# EasyEDA schematic SCH_场强表sma版_2024-12-23.json
TITLE: Sheet_1; REV: 1.0; Date: 2024-12-06; Sheet: 1/1; Company: Your Company
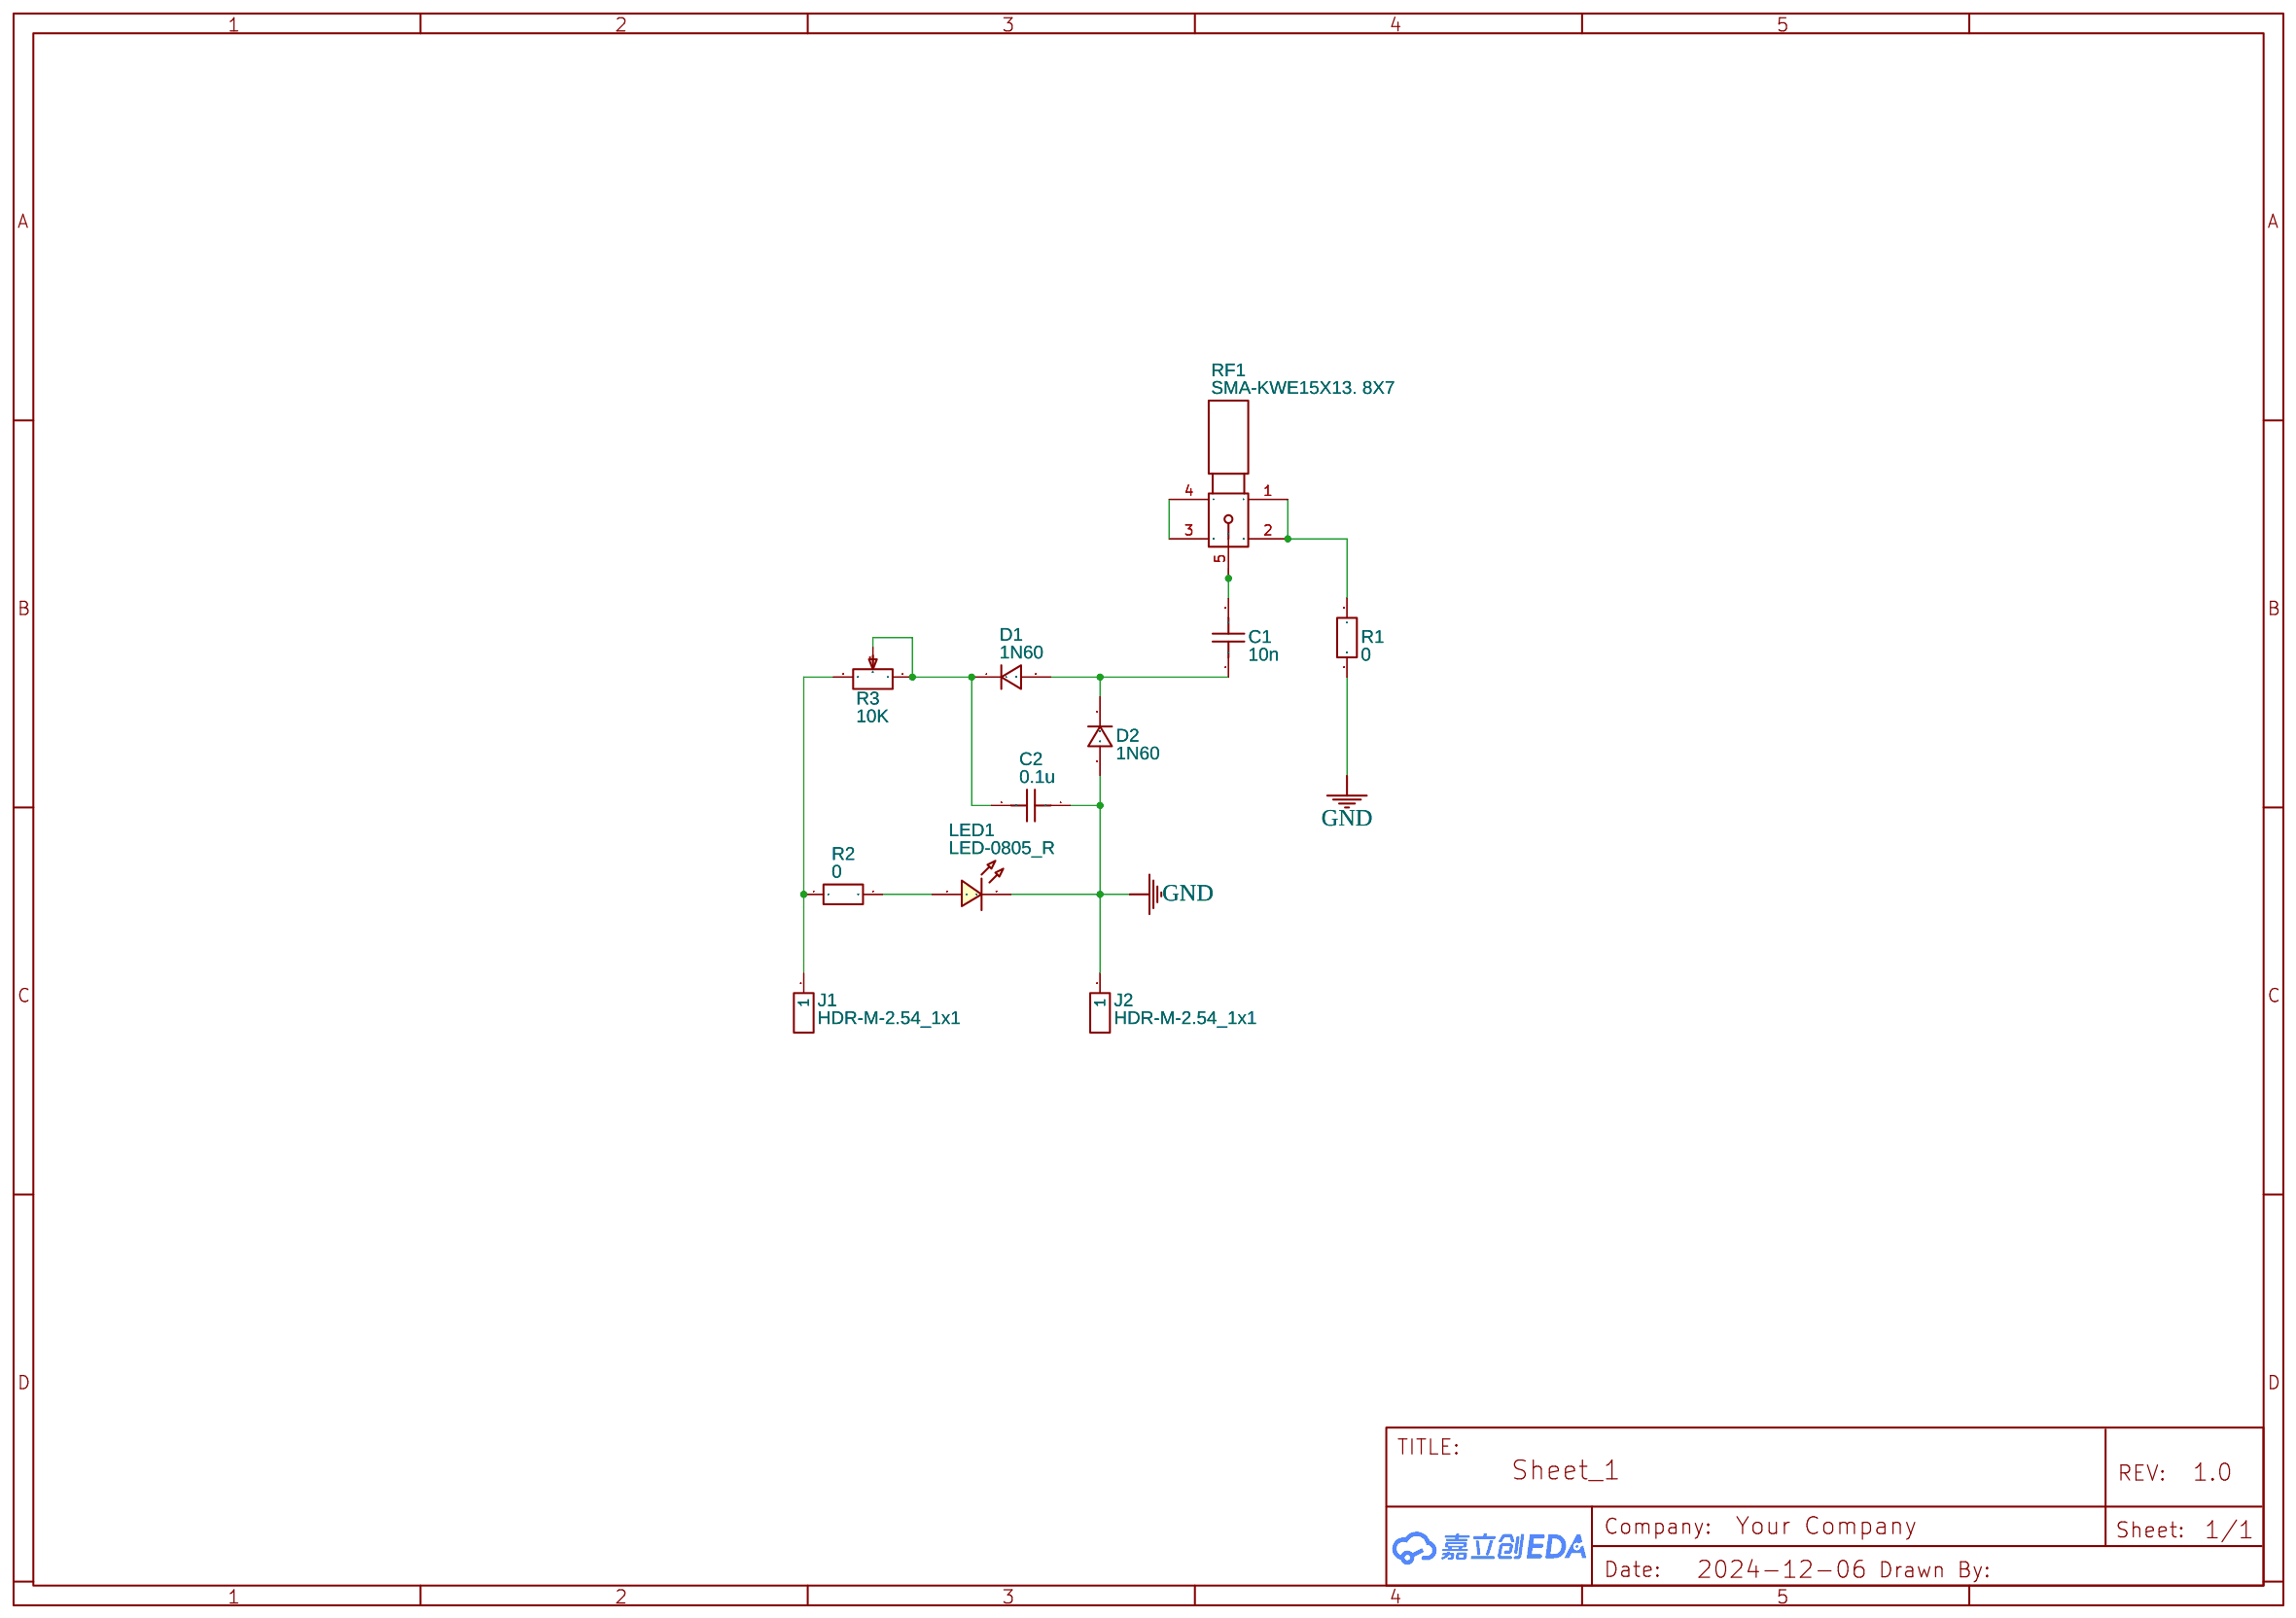
[diagram p0: schematic sheet]

## Parts
C1  10n  [C0603]
C2  0.1u  [C0603]
D1  1N60  [DO-35_BD2.0-L4.2-P8.20-D0.5-RD]
D2  1N60  [DO-35_BD2.0-L4.2-P8.20-D0.5-RD]
J1  HDR-M-2.54_1x1  [HDR-M-2.54_1X1]
J2  HDR-M-2.54_1x1  [HDR-M-2.54_1X1]
LED1  LED-0805_R  [LED0805-RD]
R1  0  [R0603]
R2  0  [R0603]
R3  10K  [RES-ADJ-TH_RK097N]
RF1  SMA-KWE15X13. 8X7  [SMA-TH_SMA-KWE]

## Library data of the parts
C1 C2 = C_0603_US: Contributor: LCEDA_Lib
D1 D2 = 1N4148: Supplier: LCSC; Supplier Part: C13769; Manufacturer: STMicroelectronics; Contributor: LCSC
J1 J2 = HDR-M-2.54_1x1: Supplier Part: C81276; Supplier: LCSC; Contributor: LCEDA_Lib
LED1 = LED-0603_R: Manufacturer: EVERLIGHT(台湾亿光); Manufacturer Part: 19-217/R6C-AL1M2VY/3T; Supplier Part: C72044; Supplier: LCSC; Contributor: LCEDA_01
R1 R2 = R_0603_EU: Contributor: LCEDA_Lib
R3 = WH148: Supplier: LCSC; Manufacturer: ALPS; Supplier Part: C97444; Contributor: gd732
RF1 = SMA-KWE15X13. 8X7: Contributor: LCSC; Supplier: LCSC; Supplier Part: C9900004212; Manufacturer: null

## Nets
GND: C2.1 D2.2 J2.1 LED1.2 R1.1
Net-(C1-1): C1.1 D1.2 D2.1
Net-(C1-2): C1.2 RF1.5
Net-(C2-2): C2.2 D1.1 R3.1 R3.2
Net-(J1-1): J1.1 R2.1 R3.3
Net-(LED1-1): LED1.1 R2.2
Net-(R1-2): R1.2 RF1.1 RF1.2
Net-(RF1-3): RF1.3 RF1.4
